# Altium project MSPAudioHarmonizer.PrjPcb
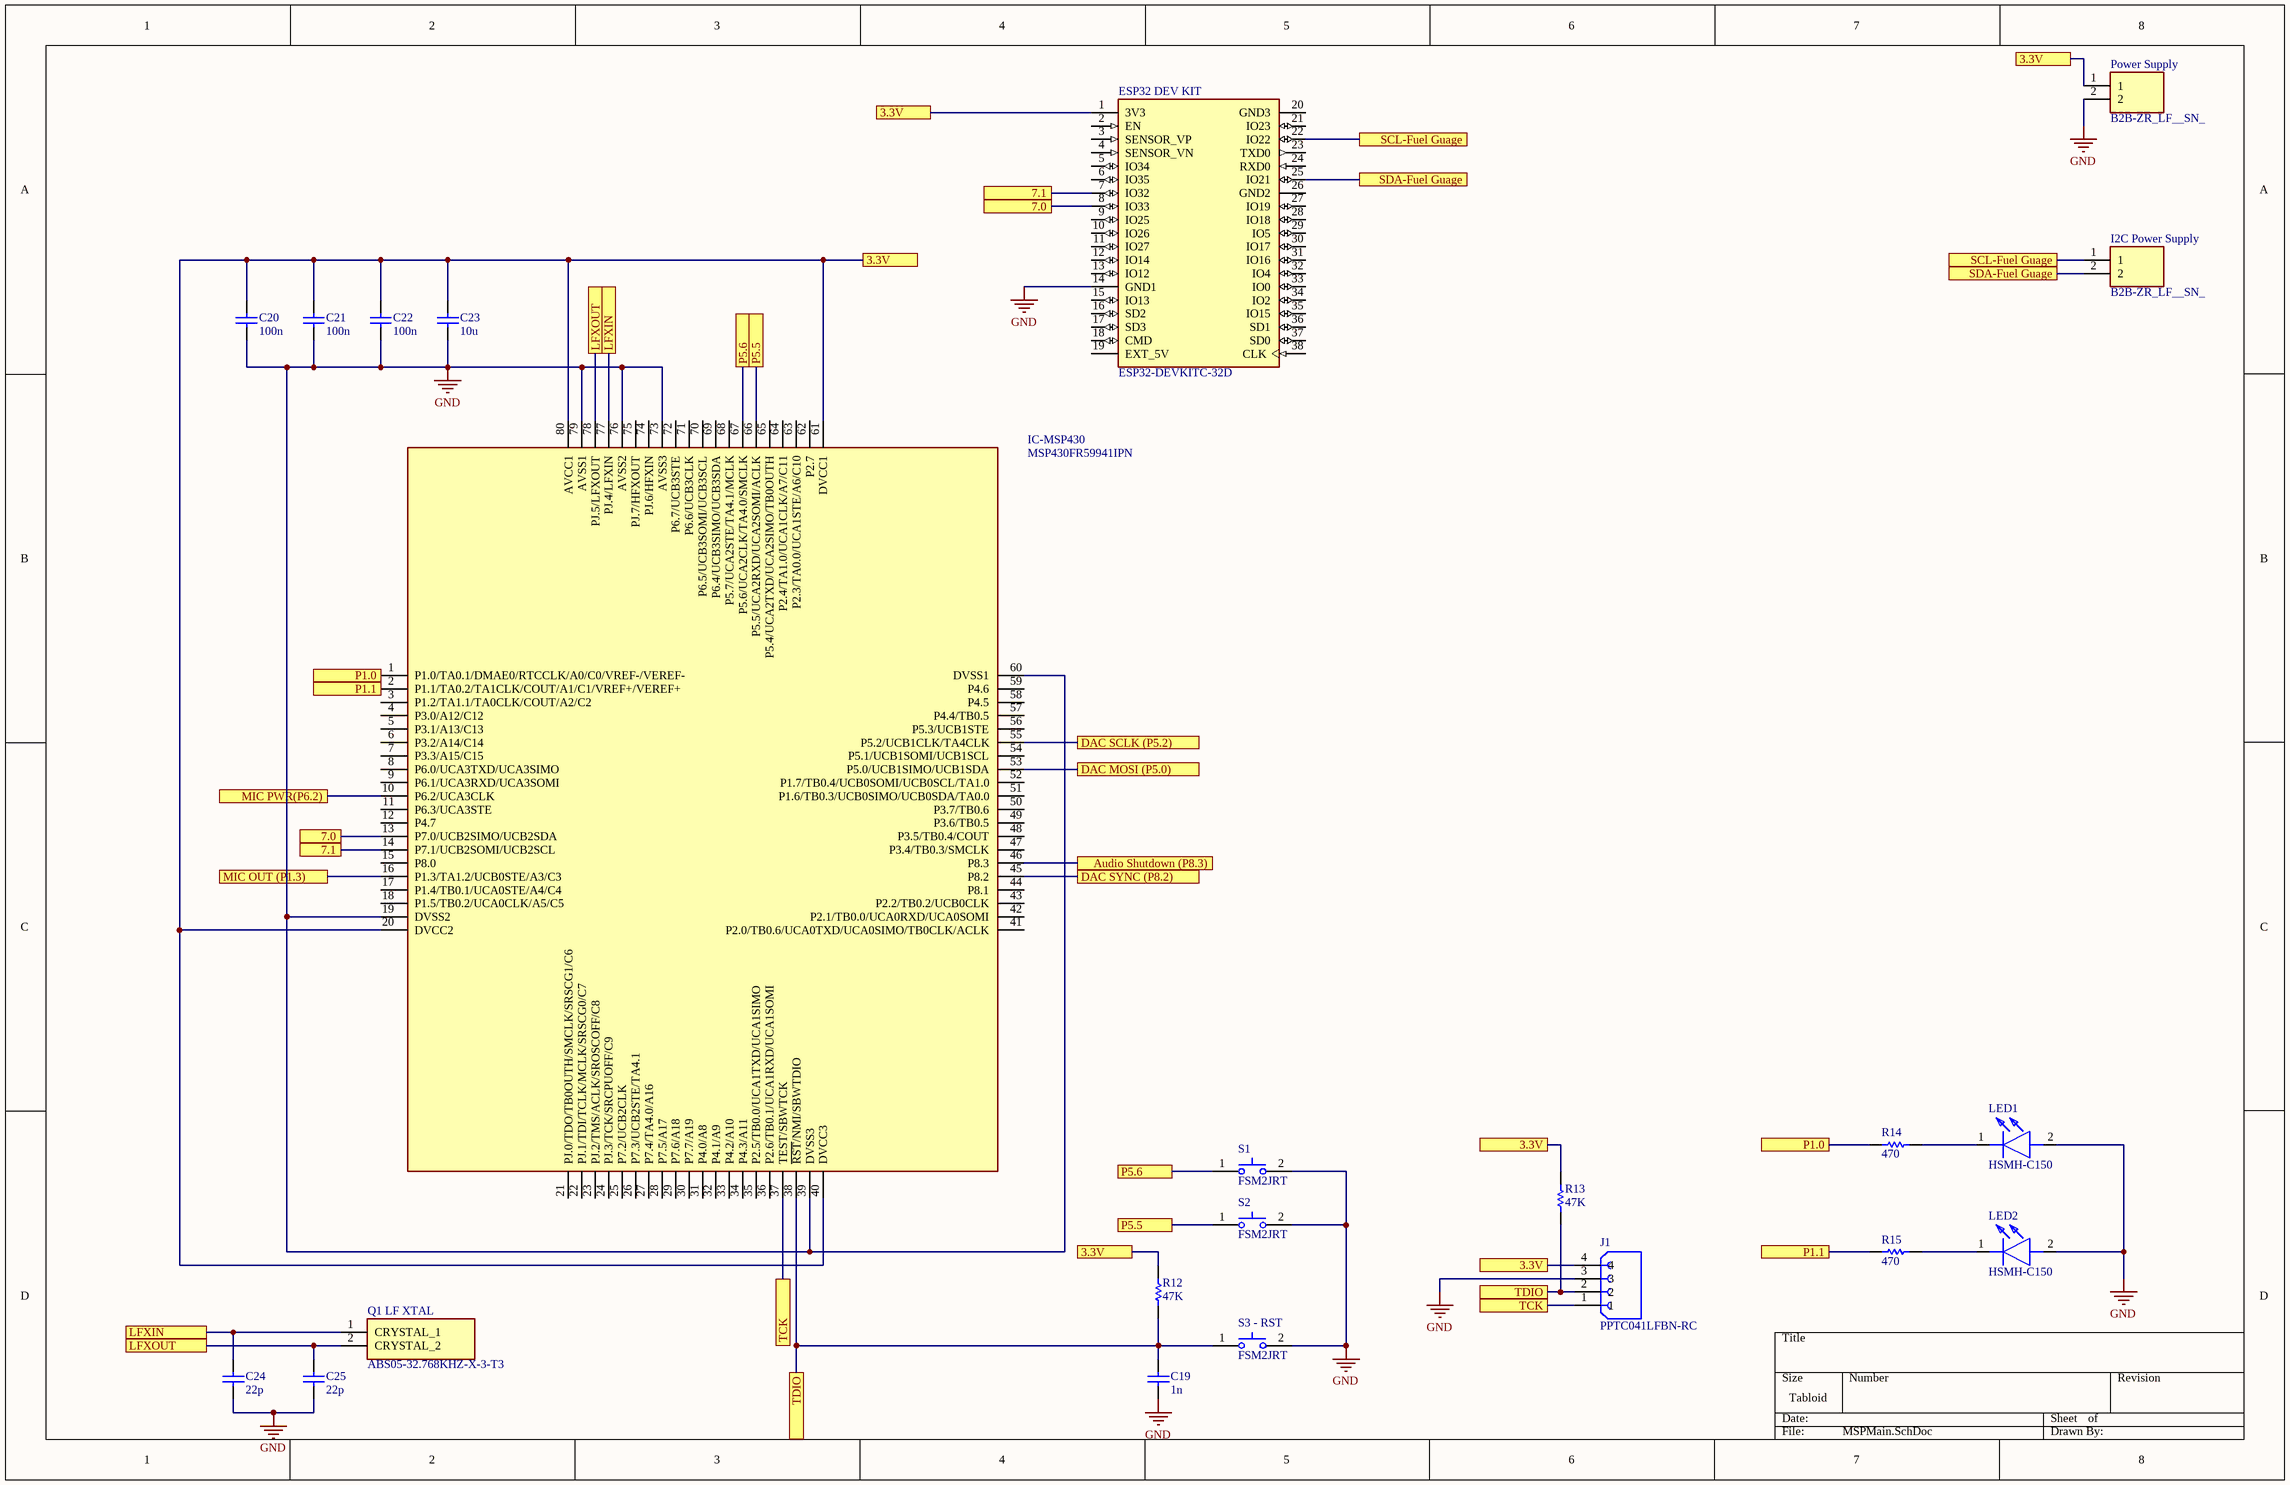
[diagram p0: MSPMain.SchDoc]
2 sheets, 59 parts. Net scope: flat (ports and power ports of the same name join across sheets).
Board file: AudioHarmonizer.PcbDoc
Sheets:
  MSPMain.SchDoc
  AudioInOut.SchDoc

## Sheet MSPMain.SchDoc
size Tabloid; SheetNumber: 1; SheetTotal: 2

### Parts
C19  1n  [CAPC1206(3216)170_M]
C20  100n  [CAPC1206(3216)170_M]
C21  100n  [CAPC1206(3216)170_M]
C22  100n  [CAPC1206(3216)170_M]
C23  10u  [CAPC1206(3216)170_M]
C24  22p  [CAPC1206(3216)170_M]
C25  22p  [CAPC1206(3216)170_M]
ESP32_DEV_KIT  ESP32-DEVKITC-32D  [MODULE_ESP32-DEVKITC-32D]
I2C_Power_Supply  B2B-ZR_LF__SN_  [SHDR2W50P0X150_1X2_450X350X450P]
IC-MSP430  MSP430FR59941IPN  [QFP50P1400X1400X160-80N]
J1  PPTC041LFBN-RC  [SULLINS_PPTC041LFBN-RC]
LED1  HSMH-C150  [LEDC3216X120N]
LED2  HSMH-C150  [LEDC3216X120N]
Power_Supply  B2B-ZR_LF__SN_  [SHDR2W50P0X150_1X2_450X350X450P]
Q1_LF_XTAL  ABS05-32.768KHZ-X-3-T3  [ABS0532768KHZX3T3]
R12  47K  [RESC3216X60X45LL10T20]
R13  47K  [RESC3216X60X45LL10T20]
R14  470  [RESC3216X60X45NL10T20]
R15  470  [RESC3216X60X45NL10T20]
S1  FSM2JRT  [FSM2JRT]
S2  FSM2JRT  [FSM2JRT]
S3_-_RST  FSM2JRT  [FSM2JRT]

### Ports
3.3V, 7.0, 7.1, Audio Shutdown (P8.3), DAC MOSI (P5.0), DAC SCLK (P5.2), DAC SYNC (P8.2), LFXIN, LFXOUT, MIC OUT (P1.3), MIC PWR(P6.2), P1.0, P1.1, P5.5, P5.6, SCL-Fuel Guage, SDA-Fuel Guage, TCK, TDIO

### Nets
GND: C19.2 C20.2 C21.2 C22.2 C23.2 C24.2 C25.2 ESP32_DEV_KIT.14(GND1) IC-MSP430.19(DVSS2) IC-MSP430.39(DVSS3) IC-MSP430.60(DVSS1) IC-MSP430.73(AVSS3) IC-MSP430.76(AVSS2) IC-MSP430.79(AVSS1) J1.3 LED1.2(A) LED2.2(A) Power_Supply.2 S1.2(NO) S2.2(NO) S3_-_RST.2(NO)
NetC3_1: IC-MSP430.10(P6.2/UCA3CLK) ; port MIC PWR(P6.2)
NetC8_1: IC-MSP430.16(P1.3/TA1.2/UCB0STE/A3/C3) ; port MIC OUT (P1.3)
NetC13_1: C20.1 C21.1 C22.1 C23.1 ESP32_DEV_KIT.1(3V3) IC-MSP430.20(DVCC2) IC-MSP430.40(DVCC3) IC-MSP430.61(DVCC1) IC-MSP430.80(AVCC1) J1.4 Power_Supply.1 R12.2 R13.2 ; port 3.3V
NetC19_1: C19.1 IC-MSP430.38(~{RST}/NMI/SBWTDIO) J1.2 R12.1 R13.1 S3_-_RST.1(COM) ; port TDIO
NetC24_1: C24.1 IC-MSP430.77(PJ.4/LFXIN) Q1_LF_XTAL.1(CRYSTAL_1) ; port LFXIN
NetC25_1: C25.1 IC-MSP430.78(PJ.5/LFXOUT) Q1_LF_XTAL.2(CRYSTAL_2) ; port LFXOUT
NetESP32_DEV_KIT_7: ESP32_DEV_KIT.7(IO32) IC-MSP430.14(P7.1/UCB2SOMI/UCB2SCL) ; port 7.1
NetESP32_DEV_KIT_8: ESP32_DEV_KIT.8(IO33) IC-MSP430.13(P7.0/UCB2SIMO/UCB2SDA) ; port 7.0
NetESP32_DEV_KIT_22: ESP32_DEV_KIT.22(IO22) I2C_Power_Supply.1 ; port SCL-Fuel Guage
NetESP32_DEV_KIT_25: ESP32_DEV_KIT.25(IO21) I2C_Power_Supply.2 ; port SDA-Fuel Guage
NetIC-AUDIOAMP_1: IC-MSP430.46(P8.3) ; port Audio Shutdown (P8.3)
NetIC-DAC_1: IC-MSP430.45(P8.2) ; port DAC SYNC (P8.2)
NetIC-DAC_2: IC-MSP430.53(P5.0/UCB1SIMO/UCB1SDA) ; port DAC MOSI (P5.0)
NetIC-DAC_3: IC-MSP430.55(P5.2/UCB1CLK/TA4CLK) ; port DAC SCLK (P5.2)
NetIC-MSP430_1: IC-MSP430.1(P1.0/TA0.1/DMAE0/RTCCLK/A0/C0/VREF-/VEREF-) R14.1 ; port P1.0
NetIC-MSP430_2: IC-MSP430.2(P1.1/TA0.2/TA1CLK/COUT/A1/C1/VREF+/VEREF+) R15.1 ; port P1.1
NetIC-MSP430_37: IC-MSP430.37(TEST/SBWTCK) J1.1 ; port TCK
NetIC-MSP430_66: IC-MSP430.66(P5.5/UCA2RXD/UCA2SOMI/ACLK) S2.1(COM) ; port P5.5
NetIC-MSP430_67: IC-MSP430.67(P5.6/UCA2CLK/TA4.0/SMCLK) S1.1(COM) ; port P5.6
NetLED1_1: LED1.1(K) R14.2
NetLED2_1: LED2.1(K) R15.2

Not connected (* = marked no-connect by the designer): ESP32_DEV_KIT 2(EN) 3(SENSOR_VP) 4(SENSOR_VN) 5(IO34) 6(IO35) 9(IO25) 10(IO26) 11(IO27) 12(IO14) 13(IO12) 15(IO13) 16(SD2) 17(SD3) 18(CMD) 19(EXT_5V) 20(GND3) 21(IO23) 23(TXD0) 24(RXD0) 26(GND2) 27(IO19) 28(IO18) 29(IO5) 30(IO17) 31(IO16) 32(IO4) 33(IO0) 34(IO2) 35(IO15) 36(SD1) 37(SD0) 38(CLK); IC-MSP430 3(P1.2/TA1.1/TA0CLK/COUT/A2/C2) 4(P3.0/A12/C12) 5(P3.1/A13/C13) 6(P3.2/A14/C14) 7(P3.3/A15/C15) 8(P6.0/UCA3TXD/UCA3SIMO) 9(P6.1/UCA3RXD/UCA3SOMI) 11(P6.3/UCA3STE) 12(P4.7) 15(P8.0) 17(P1.4/TB0.1/UCA0STE/A4/C4) 18(P1.5/TB0.2/UCA0CLK/A5/C5) 21(PJ.0/TDO/TB0OUTH/SMCLK/SRSCG1/C6) 22(PJ.1/TDI/TCLK/MCLK/SRSCG0/C7) 23(PJ.2/TMS/ACLK/SROSCOFF/C8) 24(PJ.3/TCK/SRCPUOFF/C9) 25(P7.2/UCB2CLK) 26(P7.3/UCB2STE/TA4.1) 27(P7.4/TA4.0/A16) 28(P7.5/A17) 29(P7.6/A18) 30(P7.7/A19) 31(P4.0/A8) 32(P4.1/A9) 33(P4.2/A10) 34(P4.3/A11) 35(P2.5/TB0.0/UCA1TXD/UCA1SIMO) 36(P2.6/TB0.1/UCA1RXD/UCA1SOMI) 41(P2.0/TB0.6/UCA0TXD/UCA0SIMO/TB0CLK/ACLK) 42(P2.1/TB0.0/UCA0RXD/UCA0SOMI) 43(P2.2/TB0.2/UCB0CLK) 44(P8.1) 47(P3.4/TB0.3/SMCLK) 48(P3.5/TB0.4/COUT) 49(P3.6/TB0.5) 50(P3.7/TB0.6) 51(P1.6/TB0.3/UCB0SIMO/UCB0SDA/TA0.0) 52(P1.7/TB0.4/UCB0SOMI/UCB0SCL/TA1.0) 54(P5.1/UCB1SOMI/UCB1SCL) 56(P5.3/UCB1STE) 57(P4.4/TB0.5) 58(P4.5) 59(P4.6) 62(P2.7) 63(P2.3/TA0.0/UCA1STE/A6/C10) 64(P2.4/TA1.0/UCA1CLK/A7/C11) 65(P5.4/UCA2TXD/UCA2SIMO/TB0OUTH) 68(P5.7/UCA2STE/TA4.1/MCLK) 69(P6.4/UCB3SIMO/UCB3SDA) 70(P6.5/UCB3SOMI/UCB3SCL) 71(P6.6/UCB3CLK) 72(P6.7/UCB3STE) 74(PJ.6/HFXIN) 75(PJ.7/HFXOUT)

### Library data of the parts
C19-C25 = CMP-1037-03299-1: CAP 6.8nF 50V ±10% 1206 (3216 Metric) Thickness 1.7mm SMD; Tolerance: Â±10%; Case-EIA: 1206; Case-Metric: 3216; Value: 6.8nF; Technology: SMT; Rated Voltage: 50 V; Max Thickness: 1.7 mm
ESP32_DEV_KIT = ESP32-DEVKITC-32D: EVAL BOARD FOR ESP-WROOM-32; MF: Espressif Systems; Value: *; MP: ESP32-DEVKITC-32D; Price: None; Check_prices: https://www.snapeda.com/parts/ESP32-DEVKITC-32D/Espressif%20Systems/view-part/2777395/?ref=eda; SnapEDA_Link: https://www.snapeda.com/parts/ESP32-DEVKITC-32D/Espressif%20Systems/view-part/2777395/?ref=snap; Availability: Warning; Purchase-URL: https://pricing.snapeda.com/search/part/ESP32-DEVKITC-32D/?ref=eda; Package: None
I2C_Power_Supply Power_Supply = B2B-ZR_LF__SN_: Connector; Manufacturer_Name: JST (JAPAN SOLDERLESS TERMINALS); Manufacturer_Part_Number: B2B-ZR(LF)(SN); Datasheet Link: https://componentsearchengine.com/Datasheets/2/B2B-ZR(LF)(SN).pdf; Height: 4.5mm; Arrow Part Number: B2B-ZR(LF)(SN); Arrow Price/Stock: https://www.arrow.com/en/products/b2b-zr-lf-sn/jst-manufacturing
IC-MSP430 = MSP430FR59941IPN: Integrated Circuit; Manufacturer_Name: Texas Instruments; Datasheet Link: http://www.ti.com/lit/gpn/MSP430FR59941; Height: 1.6mm; Mouser2 Part Number: 595-MSP430FR59941IPN; Mouser2 Price/Stock: https://www.mouser.com/Search/Refine.aspx?Keyword=595-MSP430FR59941IPN; Manufacturer_Part_Number: MSP430FR59941IPN
J1 = PPTC041LFBN-RC: 4 Position Header Connector Through Hole; MF: Sullins Connector; MP: PPTC041LFBN-RC; Value: *; SnapEDA_Link: https://www.snapeda.com/parts/PPTC041LFBN-RC/Sullins%20Connector%20Solutions/view-part/285917/?ref=snap; Package: None; Availability: Warning; Check_prices: https://www.snapeda.com/parts/PPTC041LFBN-RC/Sullins%20Connector%20Solutions/view-part/285917/?ref=eda; Price: None; Purchase-URL: https://pricing.snapeda.com/search/part/PPTC041LFBN-RC/?ref=eda
LED1 LED2 = HSMH-C150: LED; Manufacturer_Name: Avago Technologies; Height: 1.2mm; Mouser2 Part Number: 630-HSMH-C150; Mouser2 Price/Stock: https://www.mouser.com/Search/Refine.aspx?Keyword=630-HSMH-C150; Manufacturer_Part_Number: HSMH-C150
Q1_LF_XTAL = ABS05-32.768KHZ-X-3-T3: Crystal or Oscillator; Manufacturer_Name: ABRACON; Datasheet Link: https://abracon.com/Resonators/ABS05.pdf; Height: 0.5mm; Manufacturer_Part_Number: ABS05-32.768KHZ-X-3-T3
R12 R13 = CMP-2003-02213-1: Part Number: CRCW120647K0FKEA; Manufacturer: Vishay Dale
R14 R15 = CMP-1014-00812-2: Part Number: CRCW1206470KFKEA; Manufacturer: Vishay Dale
S1 S2 S3_-_RST = FSM2JRT: Switch (2-Pin Push); Manufacturer_Name: TE Connectivity; Height: 4.3mm; Manufacturer_Part_Number: FSM2JRT

## Sheet AudioInOut.SchDoc
size Tabloid; SheetNumber: 2; SheetTotal: 2
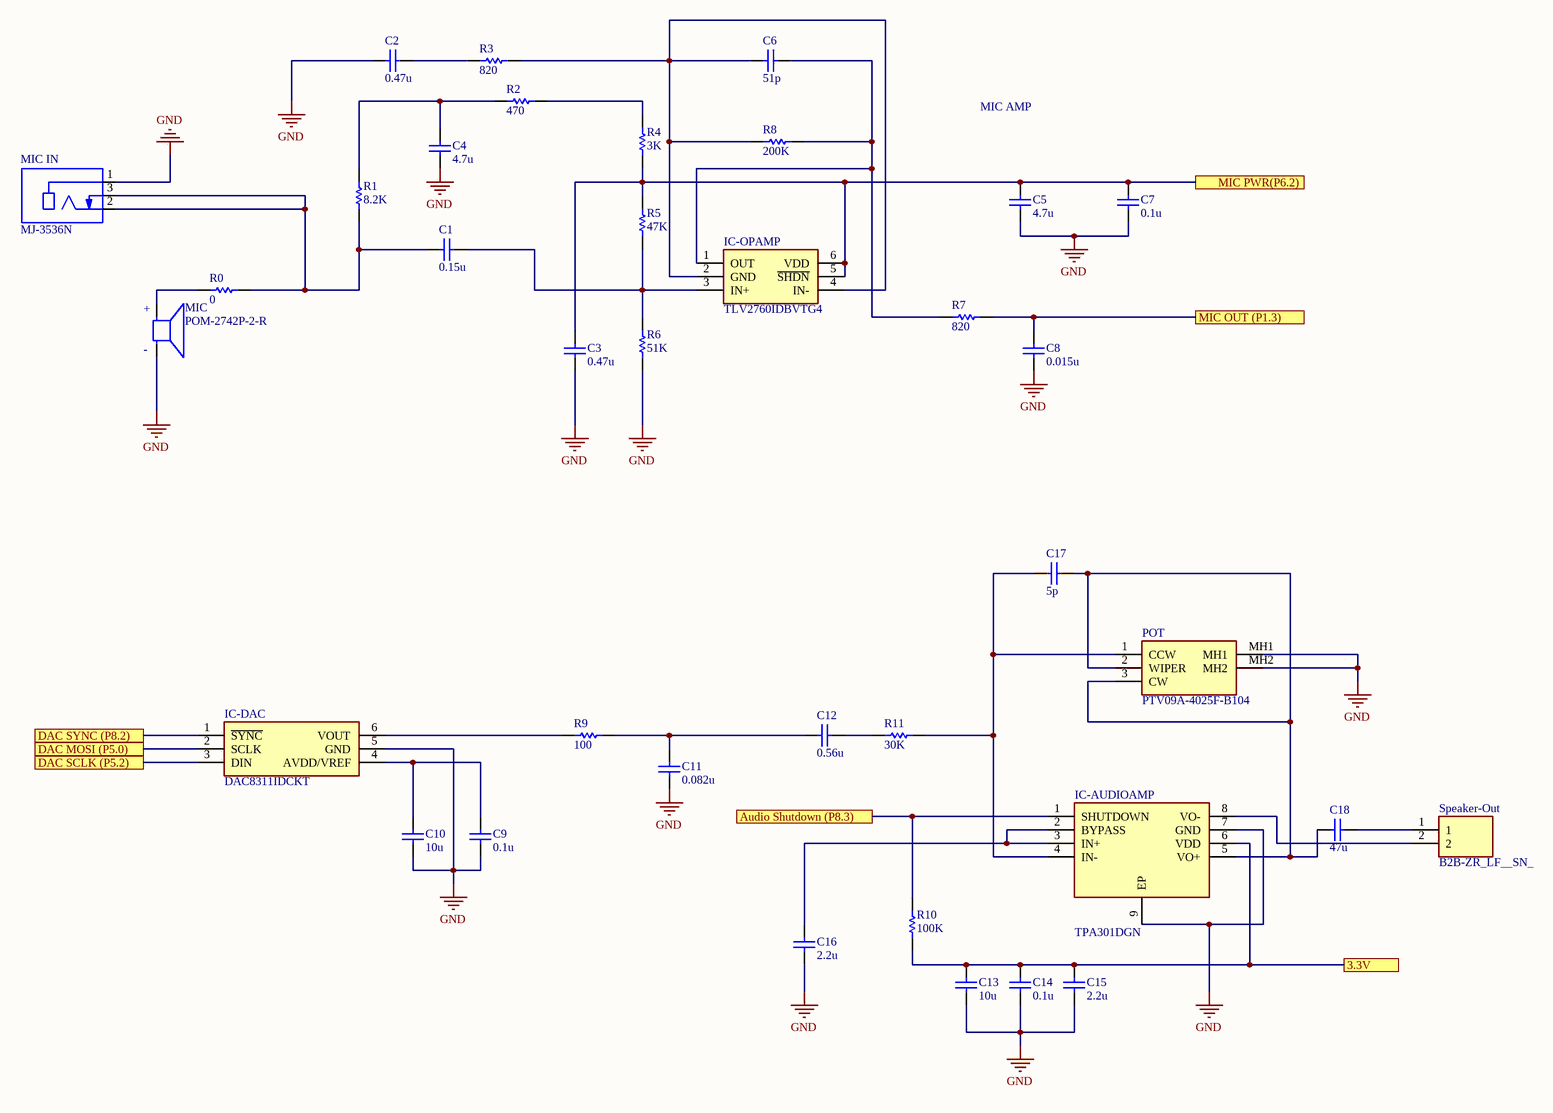
[diagram p1: AudioInOut.SchDoc]

### Parts
C1  0.15u  [CAPC1206(3216)170_M]
C2  0.47u  [CAPC1206(3216)170_M]
C3  0.47u  [CAPC1206(3216)170_M]
C4  4.7u  [CAPC1206(3216)170_M]
C5  4.7u  [CAPC1206(3216)170_M]
C6  51p  [CAPC1206(3216)170_M]
C7  0.1u  [CAPC1206(3216)170_M]
C8  0.015u  [CAPC1206(3216)170_M]
C9  0.1u  [CAPC1206(3216)170_M]
C10  10u  [CAPC1206(3216)170_M]
C11  0.082u  [CAPC1206(3216)170_M]
C12  0.56u  [CAPC1206(3216)170_M]
C13  10u  [CAPC1206(3216)170_M]
C14  0.1u  [CAPC1206(3216)170_M]
C15  2.2u  [CAPC1206(3216)170_M]
C16  2.2u  [CAPC1206(3216)170_M]
C17  5p  [CAPC1206(3216)170_M]
C18  47u  [CAPC1206(3216)170_M]
IC-AUDIOAMP  TPA301DGN  [SOP65P490X110-9N]
IC-DAC  DAC8311IDCKT  [SOT65P210X110-6N]
IC-OPAMP  TLV2760IDBVTG4  [SOT95P280X145-6N]
MIC  POM-2742P-2-R  [MIC_POM-2742P-2-R]
MIC_IN  MJ-3536N  [CUI_MJ-3536N]
POT  PTV09A-4025F-B104  [PTV09A4025FB104]
R0  0  [RESC3216X60X45NL10T20]
R1  8.2K  [RESC3216X60X45NL10T20]
R2  470  [RESC3216X60X45NL10T20]
R3  820  [RESC3216X60X45NL10T20]
R4  3K  [RESC3216X70X50LL05T20]
R5  47K  [RESC3216X60X45LL10T20]
R6  51K  [RESC3216X70X50NL20T25]
R7  820  [RESC3216X60X45NL10T20]
R8  200K  [RESC3216X60X45NL10T20]
R9  100  [RESC3216X60X45NL10T20]
R10  100K  [RESC3216X60X45NL10T20]
R11  30K  [RESC3216X60X45NL10T20]
Speaker-Out  B2B-ZR_LF__SN_  [SHDR2W50P0X150_1X2_450X350X450P]

### Ports
3.3V, Audio Shutdown (P8.3), DAC MOSI (P5.0), DAC SCLK (P5.2), DAC SYNC (P8.2), MIC OUT (P1.3), MIC PWR(P6.2)

### Nets
GND: C2.1 C3.2 C4.2 C5.2 C7.2 C8.2 C9.2 C10.2 C11.2 C13.2 C14.2 C15.2 C16.2 IC-AUDIOAMP.7(GND) IC-AUDIOAMP.9(EP) IC-DAC.5(GND) MIC.N(NEG) MIC_IN.1 POT.MH1 POT.MH2 R6.1
NetC1_1: C1.1 MIC_IN.2 MIC_IN.3 R0.1 R1.1
NetC1_2: C1.2 IC-OPAMP.3(IN+) R5.1 R6.2
NetC2_2: C2.2 R3.1
NetC3_1: C3.1 C5.1 C7.1 IC-OPAMP.5(~{SHDN}) IC-OPAMP.6(VDD) R4.1 R5.2 ; port MIC PWR(P6.2)
NetC4_1: C4.1 R1.2 R2.1
NetC6_1: C6.1 IC-OPAMP.2(GND) IC-OPAMP.4(IN-) R3.2 R8.1
NetC6_2: C6.2 IC-OPAMP.1(OUT) R7.2 R8.2
NetC8_1: C8.1 R7.1 ; port MIC OUT (P1.3)
NetC9_1: C9.1 C10.1 IC-DAC.4(AVDD/VREF)
NetC11_1: C11.1 C12.1 R9.2
NetC12_2: C12.2 R11.1
NetC13_1: C13.1 C14.1 C15.1 IC-AUDIOAMP.6(VDD) R10.1 ; port 3.3V
NetC16_1: C16.1 IC-AUDIOAMP.2(BYPASS) IC-AUDIOAMP.3(IN+)
NetC17_1: C17.1 IC-AUDIOAMP.4(IN-) POT.1(CCW) R11.2
NetC17_2: C17.2 C18.1 IC-AUDIOAMP.5(VO+) POT.2(WIPER) POT.3(CW)
NetC18_2: C18.2 Speaker-Out.1
NetIC-AUDIOAMP_1: IC-AUDIOAMP.1(SHUTDOWN) R10.2 ; port Audio Shutdown (P8.3)
NetIC-AUDIOAMP_8: IC-AUDIOAMP.8(VO-) Speaker-Out.2
NetIC-DAC_1: IC-DAC.1(~{SYNC}) ; port DAC SYNC (P8.2)
NetIC-DAC_2: IC-DAC.2(SCLK) ; port DAC MOSI (P5.0)
NetIC-DAC_3: IC-DAC.3(DIN) ; port DAC SCLK (P5.2)
NetIC-DAC_6: IC-DAC.6(VOUT) R9.1
NetMIC_P: MIC.P(POS) R0.2
NetR2_2: R2.2 R4.2

### Notes on the sheet
- MIC AMP
- (in symbol POM-2742P-2-R) +; -

### Library data of the parts
C1-C18 = CMP-1037-03299-1: as C19 on sheet MSPMain; Value: 6.8nF; Technology: SMT; Rated Voltage: 50 V; Max Thickness: 1.7 mm
IC-AUDIOAMP = TPA301DGN: Integrated Circuit; Manufacturer_Name: Texas Instruments; Datasheet Link: http://www.ti.com/lit/gpn/tpa301; Height: 1.1mm; Mouser2 Part Number: 595-TPA301DGN; Mouser2 Price/Stock: https://www.mouser.com/Search/Refine.aspx?Keyword=595-TPA301DGN; Manufacturer_Part_Number: TPA301DGN
IC-DAC = DAC8311IDCKT: Integrated Circuit; Manufacturer_Name: Texas Instruments; Datasheet Link: http://www.ti.com/lit/gpn/dac8311; Height: 1.1mm; Mouser2 Part Number: 595-DAC8311IDCKT; Mouser2 Price/Stock: https://www.mouser.com/Search/Refine.aspx?Keyword=595-DAC8311IDCKT; Manufacturer_Part_Number: DAC8311IDCKT
IC-OPAMP = TLV2760IDBVTG4: Integrated Circuit; Manufacturer_Name: Texas Instruments; Datasheet Link: https://www.ti.com/lit/ds/symlink/tlv2760.pdf?ts=1637756368752&ref_url=https%253A%252F%252Fwww.google.com%252F; Height: 1.45mm; Mouser2 Part Number: 595-TLV2760IDBVTG4; Mouser2 Price/Stock: https://www.mouser.com/Search/Refine.aspx?Keyword=595-TLV2760IDBVTG4; Manufacturer_Part_Number: TLV2760IDBVTG4
MIC = POM-2742P-2-R: ELECTRET CONDENSER MICROPHONE 6MM DIA; MF: PUI Audio; Package: None; Purchase-URL: https://pricing.snapeda.com/search/part/POM-2742P-2-R/?ref=eda; Value: *; Digi-Key_Part_Number: 668-1160-ND; SnapEDA_Link: https://www.snapeda.com/parts/POM-2742P-2-R/PUI+Audio/view-part/?ref=snap; MP: POM-2742P-2-R; Check_prices: https://www.snapeda.com/parts/POM-2742P-2-R/PUI+Audio/view-part/?ref=eda
MIC_IN = MJ-3536N: 3.5 mm, Mono, Right Angle, Through Hole, Audio Jack Connector; MF: CUI Devices; MP: MJ-3536N; Availability: Unavailable; Package: None; SnapEDA_Link: https://www.snapeda.com/parts/MJ-3536N/CUI%20Devices/view-part/559067/?ref=snap; Price: None; Value: *
POT = PTV09A-4025F-B104: Variable Resistor; Manufacturer_Name: Bourns; Datasheet Link: https://componentsearchengine.com//PTV09A-4025F-B104.pdf; Height: 25.5mm; Mouser2 Part Number: 652-PTV09A4025FB104; Mouser2 Price/Stock: https://www.mouser.com/Search/Refine.aspx?Keyword=652-PTV09A4025FB104; Manufacturer_Part_Number: PTV09A-4025F-B104
R0-R3 R7-R11 = CMP-1014-00812-2: as R14 on sheet MSPMain
R4 = CMP-1014-00562-2: Manufacturer: Panasonic; Part Number: ERJ8ENF3001V
R5 = CMP-2003-02213-1: as R12 on sheet MSPMain
R6 = CMP-2003-04477-1: Manufacturer: Panasonic; Part Number: ERA8AEB513V
Speaker-Out = B2B-ZR_LF__SN_: as I2C_Power_Supply on sheet MSPMain; Datasheet Link: https://componentsearchengine.com/Datasheets/2/B2B-ZR(LF)(SN).pdf; Height: 4.5mm; Arrow Part Number: B2B-ZR(LF)(SN); Arrow Price/Stock: https://www.arrow.com/en/products/b2b-zr-lf-sn/jst-manufacturing

## Nets that join several sheets
GND: MSPMain (21 pins), AudioInOut (21 pins)
NetC3_1: MSPMain (IC-MSP430.10), AudioInOut (7 pins)
NetC8_1: MSPMain (IC-MSP430.16), AudioInOut (C8.1 R7.1)
NetC13_1: MSPMain (13 pins), AudioInOut (5 pins)
NetIC-AUDIOAMP_1: MSPMain (IC-MSP430.46), AudioInOut (IC-AUDIOAMP.1 R10.2)
NetIC-DAC_1: MSPMain (IC-MSP430.45), AudioInOut (IC-DAC.1)
NetIC-DAC_2: MSPMain (IC-MSP430.53), AudioInOut (IC-DAC.2)
NetIC-DAC_3: MSPMain (IC-MSP430.55), AudioInOut (IC-DAC.3)